# Altium project My Little Friend.PrjPcb
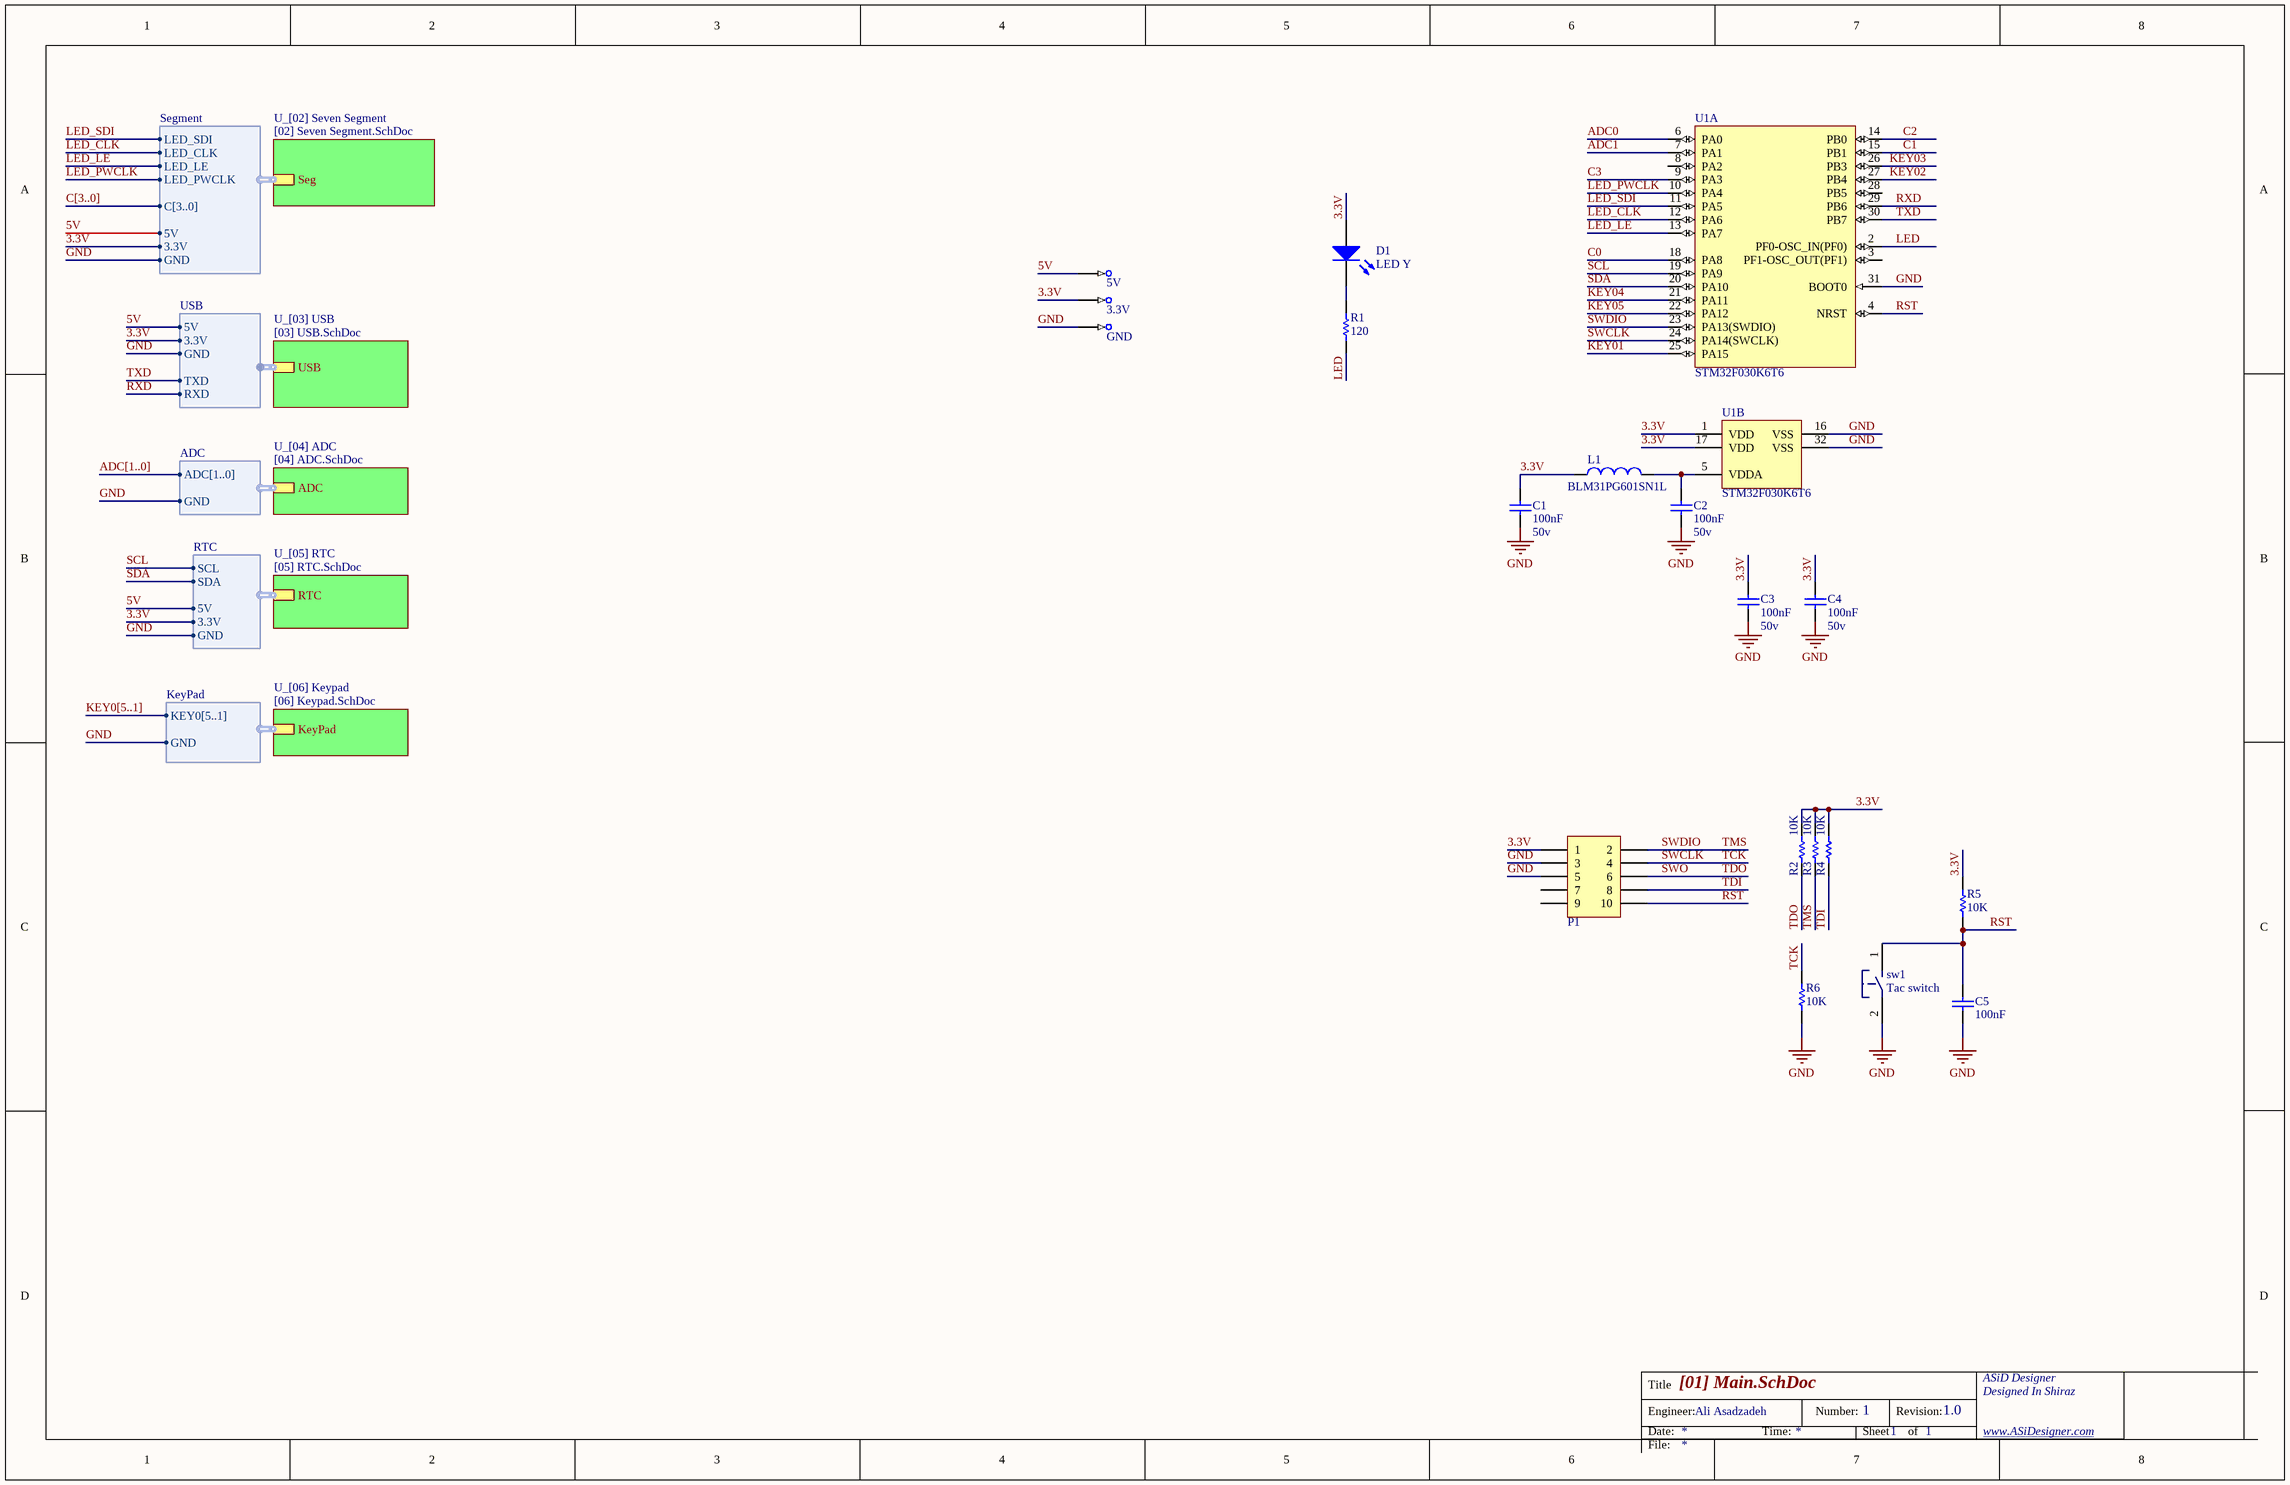
[diagram p0: [01] Main.SchDoc]
6 sheets, 65 parts. Net scope: hierarchical (ports join the sheet entries above them; power ports are global).
Board file: My Little Friend.PcbDoc
Sheets:
  [01] Main.SchDoc
    U_[02] Seven Segment = [02] Seven Segment.SchDoc
    U_[03] USB = [03] USB.SchDoc
    U_[04] ADC = [04] ADC.SchDoc
    U_[05] RTC = [05] RTC.SchDoc
    U_[06] Keypad = [06] Keypad.SchDoc

## Sheet [01] Main.SchDoc: Design 1
size Tabloid; Engineer: The ASID Designer; Organization: ASID Designer; Address1: Iran; Address2: Shiraz; Address3: P.O.Box 71765-385; DocumentNumber: 1; Revision: 1.0; SheetNumber: 1; SheetTotal: 1

### Parts
C1  Volte: 50v  [MY_0603]  (hidden comment: 100nF)
C2  Volte: 50v  [MY_0603]  (hidden comment: 100nF)
C3  Volte: 50v  [MY_0603]  (hidden comment: 100nF)
C4  Volte: 50v  [MY_0603]  (hidden comment: 100nF)
C5  100nF  [MY_0805]
D1  LED Y  [MY_LED_0805]
L1  BLM31PG601SN1L  [MY_1206]
P1  Header 5X2  [MY_2X05_BOX]  (value not drawn)
R1  120  [MY_0805]
R2  10K  [MY_0805]
R3  10K  [MY_0805]
R4  10K  [MY_0805]
R5  10K  [MY_0805]
R6  10K  [MY_0805]
sw1  Tac switch  [MY_PB-SMD]
TP1  5V  [MY_TestPin]  (no BOM)
TP2  3.3V  [MY_TestPin]  (no BOM)
TP3  GND  [MY_TestPin]  (no BOM)
U1  STM32F030K6T6  [STM-LQFP32_N]  (parts A,B of 2)

### Sub-sheets
U_[02] Seven Segment = [02] Seven Segment.SchDoc: Seg (harness Segment)
U_[03] USB = [03] USB.SchDoc: USB (harness USB)
U_[04] ADC = [04] ADC.SchDoc: ADC (harness ADC)
U_[05] RTC = [05] RTC.SchDoc: RTC (harness RTC)
U_[06] Keypad = [06] Keypad.SchDoc: KeyPad (harness KeyPad)

### Harnesses
ADC: ADC[1..0], GND
RTC: SCL, SDA, 5V, 3.3V, GND
KeyPad: GND, KEY0[5..1]
Segment: C[3..0], 5V, LED_SDI, LED_CLK, LED_LE, LED_PWCLK, 3.3V, GND
USB: 5V, GND, TXD, RXD, 3.3V

### Nets
GND: C1.1 C2.1 C3.1 C4.1 C5.1 P1.3 P1.5 R6.2 sw1.2 TP3.1 U1.16(VSS) U1.31(BOOT0) U1.32(VSS) ; sheet U_[04] ADC/ADC.GND, sheet U_[05] RTC/RTC.GND, sheet U_[06] Keypad/KeyPad.GND, sheet U_[02] Seven Segment/Seg.GND, sheet U_[03] USB/USB.GND
3.3V: C1.2 C3.2 C4.2 D1.A L1.1 P1.1 R2.1 R3.1 R4.1 R5.1 TP2.1 U1.1(VDD) U1.17(VDD) ; sheet U_[05] RTC/RTC.3.3V, sheet U_[02] Seven Segment/Seg.3.3V, sheet U_[03] USB/USB.3.3V
5V: TP1.1 ; sheet U_[05] RTC/RTC.5V, sheet U_[02] Seven Segment/Seg.5V, sheet U_[03] USB/USB.5V
ADC0: U1.6(PA0)
ADC1: U1.7(PA1)
C0: U1.18(PA8)
C1: U1.15(PB1)
C2: U1.14(PB0)
C3: U1.9(PA3)
KEY01: U1.25(PA15)
KEY02: U1.27(PB4)
KEY03: U1.26(PB3)
KEY04: U1.21(PA11)
KEY05: U1.22(PA12)
LED: R1.1 U1.2(PF0-OSC_IN(PF0))
LED_CLK: U1.12(PA6) ; sheet U_[02] Seven Segment/Seg.LED_CLK
LED_LE: U1.13(PA7) ; sheet U_[02] Seven Segment/Seg.LED_LE
LED_PWCLK: U1.10(PA4) ; sheet U_[02] Seven Segment/Seg.LED_PWCLK
LED_SDI: U1.11(PA5) ; sheet U_[02] Seven Segment/Seg.LED_SDI
RST: C5.2 P1.10 R5.2 sw1.1 U1.4(NRST)
RXD: U1.29(PB6) ; sheet U_[03] USB/USB.RXD
SCL: U1.19(PA9) ; sheet U_[05] RTC/RTC.SCL
SDA: U1.20(PA10) ; sheet U_[05] RTC/RTC.SDA
SWCLK: P1.4 R6.1 U1.24(PA14(SWCLK))  [also labelled TCK]
SWDIO: P1.2 R3.2 U1.23(PA13(SWDIO))  [also labelled TMS]
SWO: P1.6 R2.2  [also labelled TDO]
TDI: P1.8 R4.2
TXD: U1.30(PB7) ; sheet U_[03] USB/USB.TXD
NetC2_2: C2.2 L1.2 U1.5(VDDA)
NetD1_K: D1.K R1.2

Not connected (* = marked no-connect by the designer): P1 7 9; U1 3(PF1-OSC_OUT(PF1)) 8(PA2) 28(PB5)

### Buses and harness runs
bus ADC[1..0]
bus C[3..0]
bus KEY0[5..1]

### Notes on the sheet
- Title
- Engineer:
- Date:
- Ali Asadzadeh
- Time:
- Number:
- Sheet
- Revision:
- of
- www.ASiDesigner.com
- Designed In Shiraz
- ASiD Designer
- File:

### Library data of the parts
C1-C4 = Cap ceramic: None polar capacitor; ASiD Part Number: C-AS; Value: 100nF
C5 = Cap ceramic: CAP-100Nf; Value: 100nF
D1 = LED: Typical INFRARED GaAs LED; ASiD Part Number: LED-AS
L1 = Inductor: ASiD Part Number: Inductor-AS; Current: 1A; Value: BLM31PG601SN1L
P1 = Header 5X2: Header, 10-Pin, Dual row; ASiD Part Number: Header 5X2-AS
R1 = Res: Standard resistor; ASiD Part Number: Res-AS; Value: 120
R2-R6 = Res: resistor 1/4 wat; Value: 10K
sw1 = Tac switch: small tac switch; ASiD Part Number: Tac switch-AS
TP1-TP3 = Test Point: ASiD Part Number: Test Point-AS
U1 = STM32F030K6T6: ARM Cortex-M0 32-bit MCU, 32 KB Flash, 4 KB Internal RAM, 26 I/Os, 32-pin LQFP, -40 to 85 degC, Tray; FLASH Size (Prog) (kB): 32; I/Os (High Current): 26; Internal RAM Size (kB): 4; Operating Frequency(F) (Processor speed) (MHz): 48; Supply Voltage(Vcc) min (V): 2.4; DatasheetVersion: Rev. 1; PackageVersion: Rev. 1, 07/2013; PackageReference: LQFP32; PackageDescription: 32-Pin Low Profile Quad Flat Package, 7 x 7 mm Body, 0.8 mm Pitch; Supplier 1: Digi-Key; Supplier Part Number 1: 497-14046-ND; Supplier 2: Newark; Supplier Part Number 2: 19X6194; Supplier 3: Mouser; Supplier Part Number 3: 511-STM32F030K6T6; Core: ARM Cortex-M0; Packing: Tray; Mounting Technology: Surface Mount; PartNumber: STM32F030K6T6; ComponentLink1Description: Manufacturer URL; ComponentLink1URL: http://www.st.com/web/en/home.html; ComponentLink2Description: Datasheet; ComponentLink2URL: http://www.st.com/st-web-ui/static/active/en/resource/technical/document/datasheet/DM00088500.pdf; ComponentLink3Description: Package Specification; ComponentLink3URL: http://www.st.com/st-web-ui/static/active/en/resource/technical/document/datasheet/DM00088500.pdf

## Sheet [02] Seven Segment.SchDoc: Design 1
size Tabloid; Engineer: The ASID Designer; Organization: ASID Designer; Address1: Iran; Address2: Shiraz; Address3: P.O.Box 71765-385; DocumentNumber: 1; Revision: 1.0; SheetNumber: 1; SheetTotal: 1
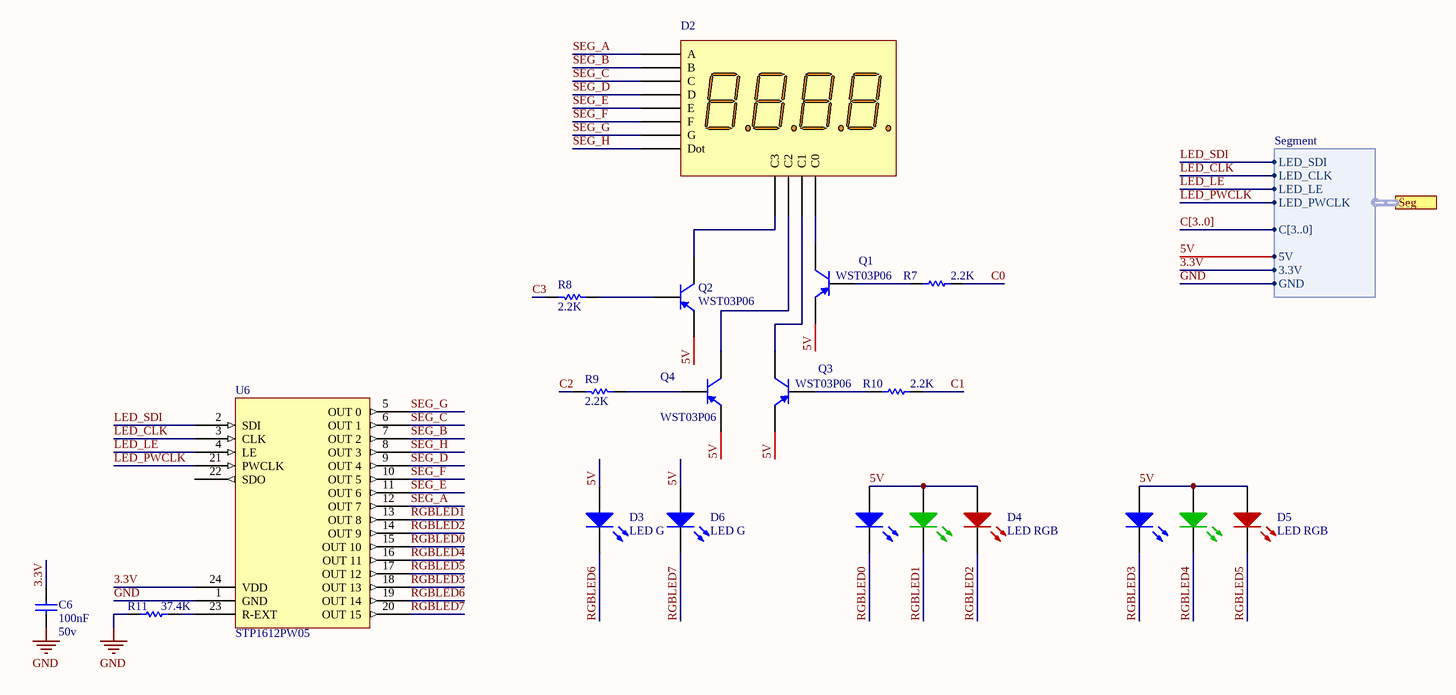
[diagram p1: [02] Seven Segment.SchDoc]

### Parts
C6  Volte: 50v  [MY_0603]  (hidden comment: 100nF)
D2  comon anode 4x7 segment  [MY_4X7_seg]  (value not drawn)
D3  LED G  [MY_LED_0805]
D4  LED RGB  [MY_RGB5050]
D5  LED RGB  [MY_RGB5050]
D6  LED G  [MY_LED_0805]
Q1  WST03P06  [SOT-23A_N]
Q2  WST03P06  [SOT-23A_N]
Q3  WST03P06  [SOT-23A_N]
Q4  WST03P06  [SOT-23A_N]
R7  2.2K  [MY_0805]
R8  2.2K  [MY_0805]
R9  2.2K  [MY_0805]
R10  2.2K  [MY_0805]
R11  37.4K  [MY_0603]
U6  STP1612PW05  [MY_SOIC24]

### Ports
Seg (harness Segment)

### Harnesses
Segment: C[3..0], 5V, LED_SDI, LED_CLK, LED_LE, LED_PWCLK, 3.3V, GND

### Nets
GND: C6.1 R11.1 U6.1(GND) ; port Seg.GND
3.3V: C6.2 U6.24(VDD) ; port Seg.3.3V
5V: D3.A D4.AB(A) D4.AG(A) D4.AR(A) D5.AB(A) D5.AG(A) D5.AR(A) D6.A Q1.2(E) Q2.2(E) Q3.2(E) Q4.2(E) ; port Seg.5V
C0: R7.2
C1: R10.2
C2: R9.2
C3: R8.2
LED_CLK: U6.3(CLK) ; port Seg.LED_CLK
LED_LE: U6.4(LE) ; port Seg.LED_LE
LED_PWCLK: U6.21(PWCLK) ; port Seg.LED_PWCLK
LED_SDI: U6.2(SDI) ; port Seg.LED_SDI
RGBLED0: D4.KB(K) U6.15(OUT_10)
RGBLED1: D4.KG(K) U6.13(OUT_8)
RGBLED2: D4.KR(K) U6.14(OUT_9)
RGBLED3: D5.KB(K) U6.18(OUT_13)
RGBLED4: D5.KG(K) U6.16(OUT_11)
RGBLED5: D5.KR(K) U6.17(OUT_12)
RGBLED6: D3.K U6.19(OUT_14)
RGBLED7: D6.K U6.20(OUT_15)
SEG_A: D2.11(A) U6.12(OUT_7)
SEG_B: D2.7(B) U6.7(OUT_2)
SEG_C: D2.4(C) U6.6(OUT_1)
SEG_D: D2.2(D) U6.9(OUT_4)
SEG_E: D2.1(E) U6.11(OUT_6)
SEG_F: D2.10(F) U6.10(OUT_5)
SEG_G: D2.5(G) U6.5(OUT_0)
SEG_H: D2.3(Dot) U6.8(OUT_3)
NetD2_6: D2.6(C3) Q2.3(C)
NetD2_8: D2.8(C2) Q4.3(C)
NetD2_9: D2.9(C1) Q3.3(C)
NetD2_12: D2.12(C0) Q1.3(C)
NetQ1_1: Q1.1(B) R7.1
NetQ2_1: Q2.1(B) R8.1
NetQ3_1: Q3.1(B) R10.1
NetQ4_1: Q4.1(B) R9.1
NetR11_2: R11.2 U6.23(R-EXT)

Not connected (* = marked no-connect by the designer): U6 22(SDO)

### Buses and harness runs
bus C[3..0]

### Notes on the sheet
- Title
- Engineer:
- Date:
- Ali Asadzadeh
- Time:
- Number:
- Sheet
- Revision:
- of
- www.ASiDesigner.com
- Designed In Shiraz
- ASiD Designer
- File:

### Library data of the parts
C6 = Cap ceramic: as C1 on sheet [01] Main; Value: 100nF
D2 = 4x7 segment: ASiD Part Number: -AS
D3 D6 = LED: as D1 on sheet [01] Main
D4 D5 = LED RGB: Enhanced Power RGB LED; ASiD Part Number: RGB LED
Q1-Q4 = BC807-16: PNP General Purpose Amplifier; Published: 8-Jun-2000; LatestRevisionDate: 20-Nov-2009; LatestRevisionNote: IPC-7351 Footprint Added.; DatasheetVersion: 1997; PackageVersion: Sep-1998; PackageReference: SOT-23A; Publisher: Altium Limited; PackageDescription: 3-Pin SOT-23 Package 0.95 mm Pitch, 2.3 mm Lead Span; ComponentLink1Description: Manufacturer Link; ComponentLink1URL: http://www.fairchildsemi.com/; ComponentLink2Description: Datasheet; ComponentLink2URL: http://www.fairchildsemi.com/ds/BC%2FBC807.pdf
R7-R11 = Res: as R1 on sheet [01] Main
  R7-R10: Value: 2.2K
  R11: Value: 37.4K
U6 = STP1612PW05: 16-channel LED driver with 16-bit PWM

## Sheet [03] USB.SchDoc: Design 1
size Tabloid; Engineer: The ASID Designer; Organization: ASID Designer; Address1: Iran; Address2: Shiraz; Address3: P.O.Box 71765-385; DocumentNumber: 1; Revision: 1.0; SheetNumber: 1; SheetTotal: 1
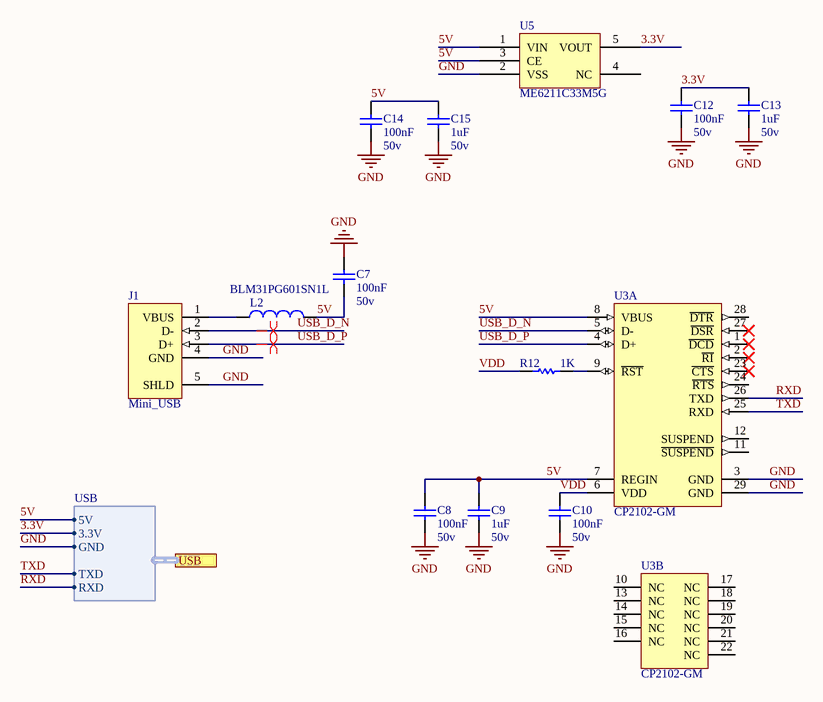
[diagram p2: [03] USB.SchDoc]

### Parts
C7  Volte: 50v  [MY_0603]  (hidden comment: 100nF)
C8  Volte: 50v  [MY_0603]  (hidden comment: 100nF)
C9  Volte: 50v  [MY_0603]  (hidden comment: 1uF)
C10  Volte: 50v  [MY_0603]  (hidden comment: 100nF)
C12  Volte: 50v  [MY_0603]  (hidden comment: 100nF)
C13  Volte: 50v  [MY_0603]  (hidden comment: 1uF)
C14  Volte: 50v  [MY_0603]  (hidden comment: 100nF)
C15  Volte: 50v  [MY_0603]  (hidden comment: 1uF)
J1  Mini_USB  [MY_Micro_USB_B]
L2  BLM31PG601SN1L  [MY_1206]
R12  1K  [MY_0603]
U3  CP2102-GM  [SLAB-QFN-28-3125x3125TP_N]  (parts A,B of 2)
U5  ME6211C33M5G  [MY_SOT23-5]

### Ports
USB (harness USB)

### Harnesses
USB: 5V, GND, TXD, RXD, 3.3V

### Nets
GND: C7.1 C8.1 C9.1 C10.1 C12.2 C13.2 C14.2 C15.1 J1.4(GND) J1.5(SHLD) U3.3(GND) U3.29(GND) U5.2(VSS) ; port USB.GND
3.3V: C12.1 C13.1 U5.5(VOUT) ; port USB.3.3V
5V: C7.2 C8.2 C9.2 C14.1 C15.2 L2.2 U3.7(REGIN) U3.8(VBUS) U5.1(VIN) U5.3(CE) ; port USB.5V
RXD: U3.26(TXD) ; port USB.RXD
TXD: U3.25(RXD) ; port USB.TXD
USB_D_N: J1.2(D-) U3.5(D-)
USB_D_P: J1.3(D+) U3.4(D+)
VDD: C10.2 R12.1 U3.6(VDD)
NetJ1_1: J1.1(VBUS) L2.1
NetR12_2: R12.2 U3.9(~{RST})

Not connected (* = marked no-connect by the designer): U3 1(~{DCD})* 2(~{RI})* 10(NC) 11(~{SUSPEND}) 12(SUSPEND) 13(NC) 14(NC) 15(NC) 16(NC) 17(NC) 18(NC) 19(NC) 20(NC) 21(NC) 22(NC) 23(~{CTS})* 24(~{RTS}) 27(~{DSR})* 28(~{DTR}); U5 4(NC)

### Layout directives
differential pair: USB_D_N, USB_D_P

### Notes on the sheet
- Title
- Engineer:
- Date:
- Ali Asadzadeh
- Time:
- Number:
- Sheet
- Revision:
- of
- www.ASiDesigner.com
- Designed In Shiraz
- ASiD Designer
- File:

### Library data of the parts
C7-C10 C12-C15 = Cap ceramic: as C1 on sheet [01] Main
  C7 C8 C10 C12 C14: Value: 100nF
  C9 C13 C15: Value: 1uF
J1 = Mini_USB: USB 2.0, Right Angle, SMT, B Type, Receptacle, 5 Position, Black; ASiD Part Number: Mini_USB-AS
L2 = Inductor: as L1 on sheet [01] Main; Value: BLM31PG601SN1L
R12 = Res: as R1 on sheet [01] Main; Value: 1K
U3 = CMP-0511-00012-1: Single-Chip USB to UART Bridge, 1024 Bytes EEPROM, -40 to 85 degC, 28-pin QFN, Tube; Manufacturer: Silicon Labs; Internal Oscillator: TRUE; Sub-Family: USB Bridges; ComponentLink3Description: Package Specification; PackageDescription: 28-Pin Quad-Flat No-Leads Package, Body 5 x 5 mm, Pitch 0.5 mm; PartNumber: CP2102-GM; EEPROM: 1024 Bytes; Mounting Technology: Surface Mount; ComponentLink2URL: http://www.silabs.com/Support%20Documents/TechnicalDocs/CP2102-9.pdf; DatasheetVersion: Rev. 1.5; ComponentLink1URL: http://www.silabs.com/; ComponentLink2Description: Datasheet; Code_JEDEC: MO-220; PackageReference: QFN-28; Code_IPC: J-STD-020C; ComponentLink3URL: http://www.silabs.com/Support%20Documents/TechnicalDocs/C8051T61x.pdf; ComponentLink1Description: Manufacturer URL; PartId: 1
U5 = ME6211C33M5G: High Speed LDO Regulators, High PSRR, Low noise

## Sheet [04] ADC.SchDoc: Design 1
size Tabloid; Engineer: The ASID Designer; Organization: ASID Designer; Address1: Iran; Address2: Shiraz; Address3: P.O.Box 71765-385; DocumentNumber: 1; Revision: 1.0; SheetNumber: 1; SheetTotal: 1
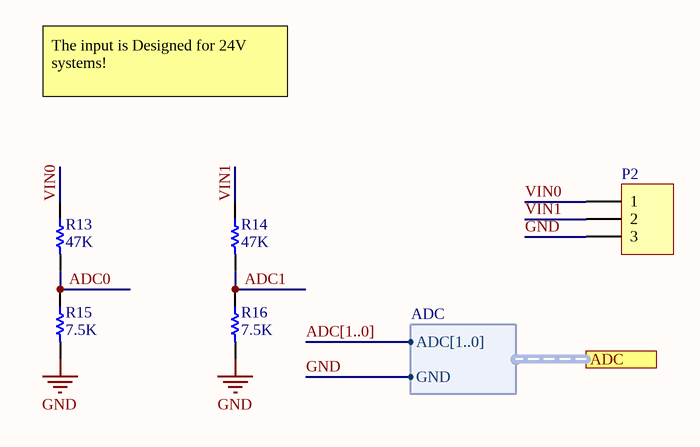
[diagram p3: [04] ADC.SchDoc]

### Parts
P2  Header 3  [MY_ECH381H_03P]  (value not drawn)
R13  47K  [MY_0805]
R14  47K  [MY_0805]
R15  7.5K  [MY_0805]
R16  7.5K  [MY_0805]

### Ports
ADC (harness ADC)

### Harnesses
ADC: ADC[1..0], GND

### Nets
GND: P2.3 R15.2 R16.2 ; port ADC.GND
ADC0: R13.2 R15.1
ADC1: R14.2 R16.1
VIN0: P2.1 R13.1
VIN1: P2.2 R14.1

### Buses and harness runs
bus ADC[1..0]

### Notes on the sheet
- The input is Designed for 24V systems!
- Title
- Engineer:
- Date:
- Ali Asadzadeh
- Time:
- Number:
- Sheet
- Revision:
- of
- www.ASiDesigner.com
- Designed In Shiraz
- ASiD Designer
- File:

### Library data of the parts
P2 = Header 3: Header, 3-Pin; ASiD Part Number: Header 3-AS
R13-R16 = Res: as R1 on sheet [01] Main
  R13 R14: Value: 47K
  R15 R16: Value: 7.5K

## Sheet [05] RTC.SchDoc: Design 1
size Tabloid; Engineer: The ASID Designer; Organization: ASID Designer; Address1: Iran; Address2: Shiraz; Address3: P.O.Box 71765-385; DocumentNumber: 1; Revision: 1.0; SheetNumber: 1; SheetTotal: 1
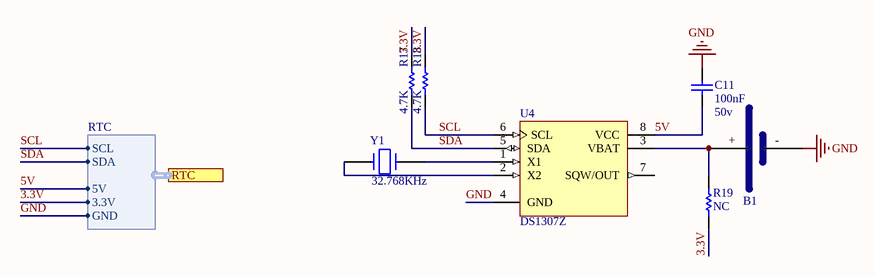
[diagram p4: [05] RTC.SchDoc]

### Parts
B1  Littium Battery  [MY_RTC BAT SMD]  (value not drawn)
C11  Volte: 50v  [MY_0603]  (hidden comment: 100nF)
R17  4.7K  [MY_0603]
R18  4.7K  [MY_0603]
R19  NC  [MY_0805]
U4  DS1307Z  [SOIC8N_N]
Y1  32.768KHz  [MY_RTC_Crystal]

### Ports
RTC (harness RTC)

### Harnesses
RTC: SCL, SDA, 5V, 3.3V, GND

### Nets
GND: B1.- C11.2 U4.4(GND) ; port RTC.GND
3.3V: R17.1 R18.1 R19.2 ; port RTC.3.3V
5V: C11.1 U4.8(VCC) ; port RTC.5V
SCL: R18.2 U4.6(SCL) ; port RTC.SCL
SDA: R17.2 U4.5(SDA) ; port RTC.SDA
NetB1_+: B1.+ R19.1 U4.3(VBAT)
NetU4_1: U4.1(X1) Y1.2
NetU4_2: U4.2(X2) Y1.1

Not connected (* = marked no-connect by the designer): B1 0; U4 7(SQW/OUT)

### Notes on the sheet
- Title
- Engineer:
- Date:
- Ali Asadzadeh
- Time:
- Number:
- Sheet
- Revision:
- of
- www.ASiDesigner.com
- Designed In Shiraz
- ASiD Designer
- File:

### Library data of the parts
B1 = Battery: 3V PC Littium Battery
C11 = Cap ceramic: as C1 on sheet [01] Main; Value: 100nF
R17 R18 = Res: as R1 on sheet [01] Main; Value: 4.7K
R19 = Res: resistor 1/4 wat; Value: NC
U4 = DS1307Z: 64 X 8 Serial Real-Time Clock; Published: 13-Oct-2000; LatestRevisionDate: 13-Apr-2006; LatestRevisionNote: IPC-7351 Footprint Added.; DatasheetVersion: 10-Aug-1999; PackageVersion: 1999; PackageReference: SOIC8N; Publisher: Altium Limited; PackageDescription: 8-Pin Small Outline Integrated Circuit 1.27 mm Pitch; Code_IPC: SOIC127P600-8; ComponentLink1Description: Manufacturer Link; ComponentLink1URL: http://www.maxim-ic.com/; ComponentLink2Description: Datasheet; ComponentLink2URL: http://pdfserv.maxim-ic.com/en/ds/DS1307.pdf; ComponentLink3Description: Discontinuation Notice; ComponentLink3URL: http://www.maxim-ic.com/qa/pdfs/non-obsolescence-letter.pdf
Y1 = CRYSTAL: ASiD Part Number: Crystal-AS

## Sheet [06] Keypad.SchDoc: Design 1
size Tabloid; Engineer: The ASID Designer; Organization: ASID Designer; Address1: Iran; Address2: Shiraz; Address3: P.O.Box 71765-385; DocumentNumber: 1; Revision: 1.0; SheetNumber: 1; SheetTotal: 1
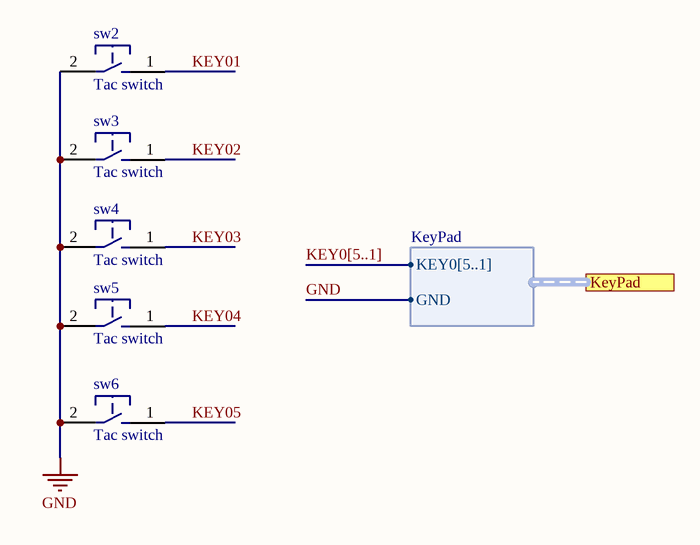
[diagram p5: [06] Keypad.SchDoc]

### Parts
sw2  Tac switch  [MY_PB-SMD]
sw3  Tac switch  [MY_PB-SMD]
sw4  Tac switch  [MY_PB-SMD]
sw5  Tac switch  [MY_PB-SMD]
sw6  Tac switch  [MY_PB-SMD]

### Ports
KeyPad (harness KeyPad)

### Harnesses
KeyPad: GND, KEY0[5..1]

### Nets
GND: sw2.2 sw3.2 sw4.2 sw5.2 sw6.2 ; port KeyPad.GND
KEY01: sw2.1
KEY02: sw3.1
KEY03: sw4.1
KEY04: sw5.1
KEY05: sw6.1

### Buses and harness runs
bus KEY0[5..1]

### Notes on the sheet
- Title
- Engineer:
- Date:
- Ali Asadzadeh
- Time:
- Number:
- Sheet
- Revision:
- of
- www.ASiDesigner.com
- Designed In Shiraz
- ASiD Designer
- File:

### Library data of the parts
sw2-sw6 = Tac switch: as sw1 on sheet [01] Main

## Nets that join several sheets
GND: [01] Main (13 pins), [02] Seven Segment (C6.1 R11.1 U6.1), [03] USB (13 pins), [04] ADC (P2.3 R15.2 R16.2), [05] RTC (B1.- C11.2 U4.4), [06] Keypad (5 pins)
3.3V: [01] Main (13 pins), [02] Seven Segment (C6.2 U6.24), [03] USB (C12.1 C13.1 U5.5), [05] RTC (R17.1 R18.1 R19.2)
5V: [01] Main (TP1.1), [02] Seven Segment (12 pins), [03] USB (10 pins), [05] RTC (C11.1 U4.8)
ADC0: [01] Main (U1.6), [04] ADC (R13.2 R15.1)
ADC1: [01] Main (U1.7), [04] ADC (R14.2 R16.1)
C0: [01] Main (U1.18), [02] Seven Segment (R7.2)
C1: [01] Main (U1.15), [02] Seven Segment (R10.2)
C2: [01] Main (U1.14), [02] Seven Segment (R9.2)
C3: [01] Main (U1.9), [02] Seven Segment (R8.2)
KEY01: [01] Main (U1.25), [06] Keypad (sw2.1)
KEY02: [01] Main (U1.27), [06] Keypad (sw3.1)
KEY03: [01] Main (U1.26), [06] Keypad (sw4.1)
KEY04: [01] Main (U1.21), [06] Keypad (sw5.1)
KEY05: [01] Main (U1.22), [06] Keypad (sw6.1)
LED_CLK: [01] Main (U1.12), [02] Seven Segment (U6.3)
LED_LE: [01] Main (U1.13), [02] Seven Segment (U6.4)
LED_PWCLK: [01] Main (U1.10), [02] Seven Segment (U6.21)
LED_SDI: [01] Main (U1.11), [02] Seven Segment (U6.2)
RXD: [01] Main (U1.29), [03] USB (U3.26)
SCL: [01] Main (U1.19), [05] RTC (R18.2 U4.6)
SDA: [01] Main (U1.20), [05] RTC (R17.2 U4.5)
TXD: [01] Main (U1.30), [03] USB (U3.25)